# EAGLE design Adafruit 1.14-inch 240x135 Color TFT (EAGLE 9.3.2)
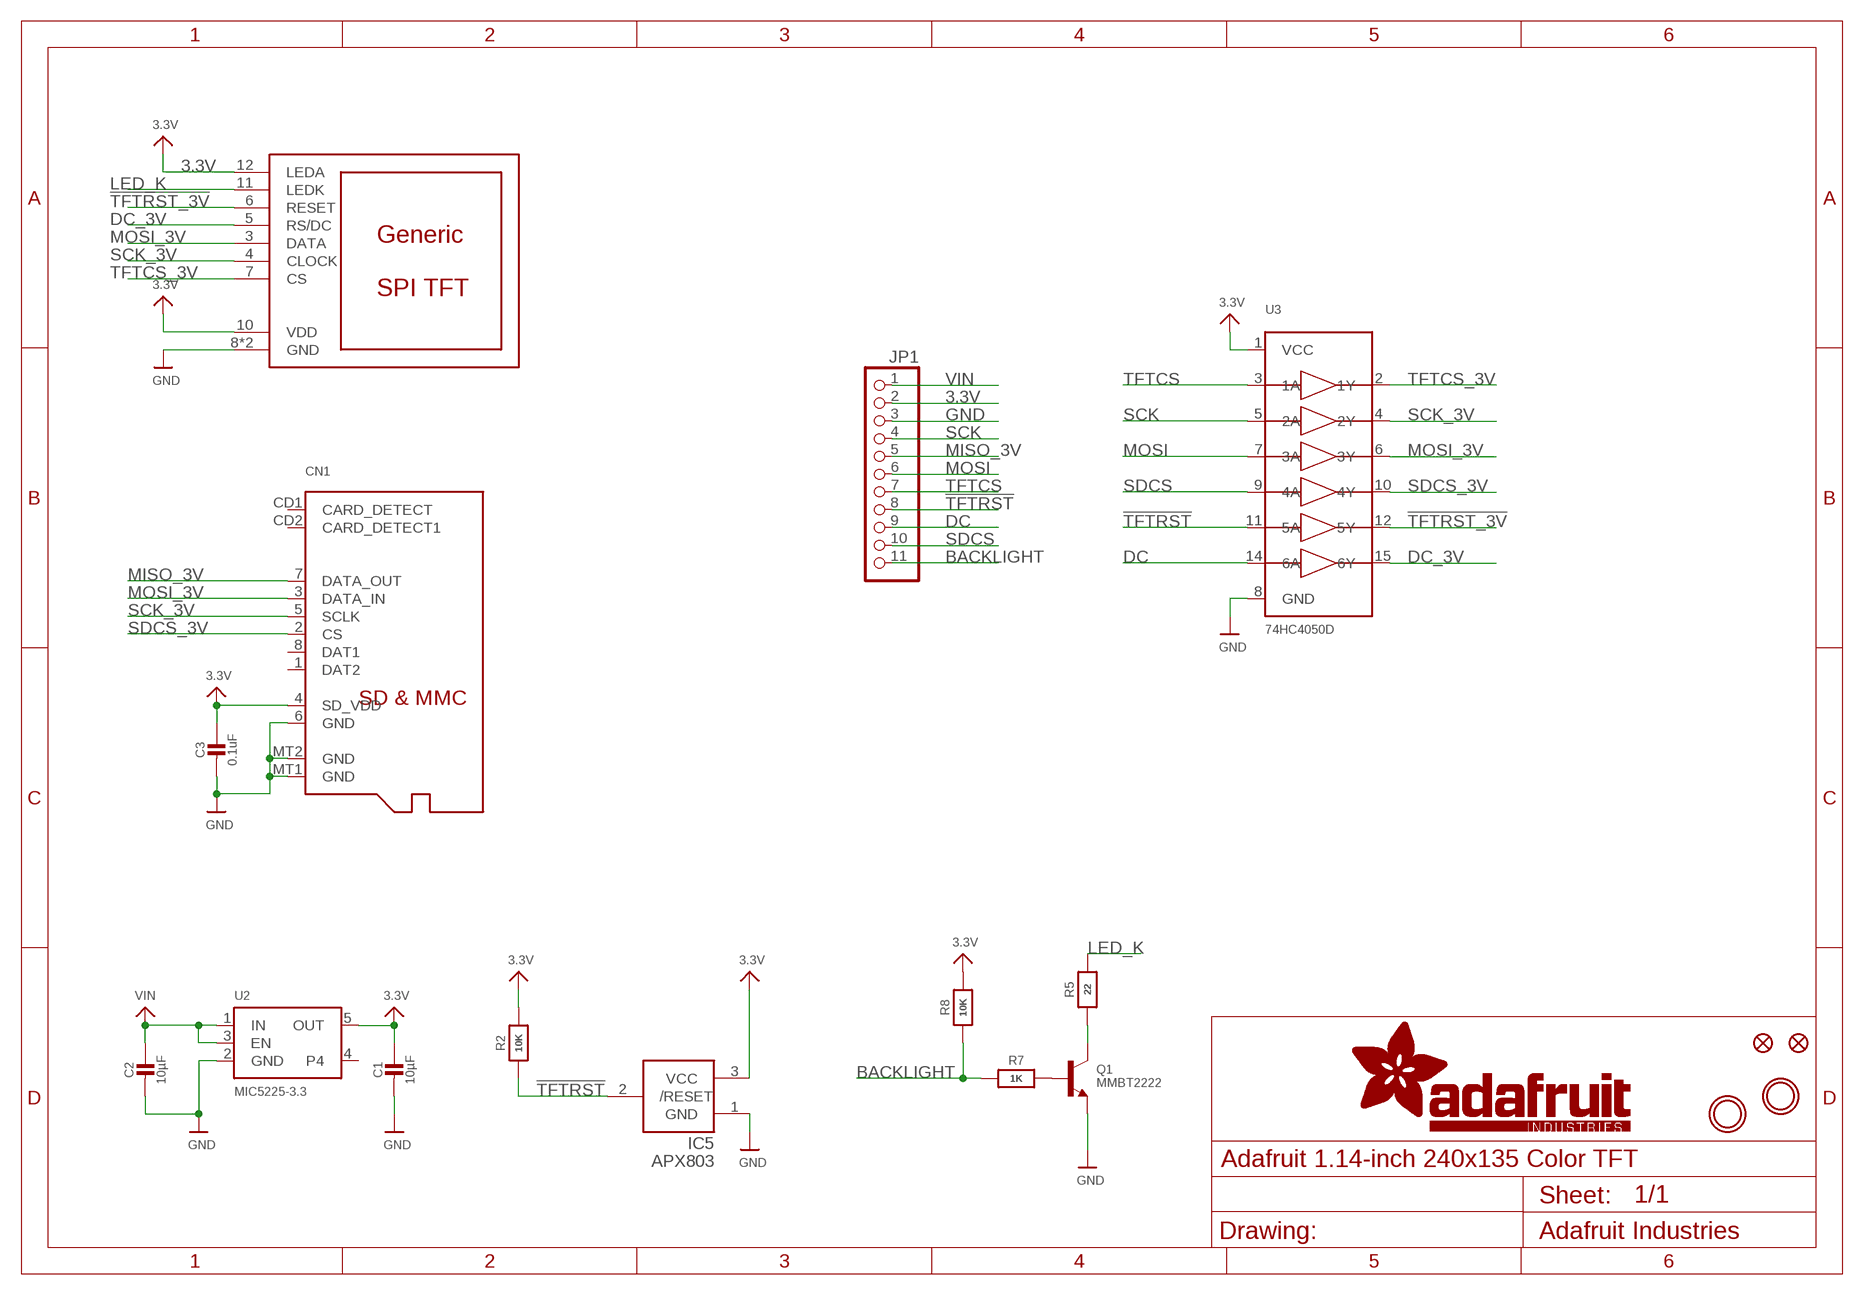
[diagram p0: schematic, sheet 1]

## Parts
C1  10µF  CAP_CERAMIC0805-NOOUTLINE  [0805-NO]
C2  10µF  CAP_CERAMIC0805-NOOUTLINE  [0805-NO]
C3  0.1uF  CAP_CERAMIC0805-NOOUTLINE  [0805-NO]
CN1  MICROSD  [MICROSD]
DISP1  DISP_LCD_GENERIC_SPI_1.14IN_240X135_WRAPUNDER  [TFT_1.14IN_240X135_WRAPUNDER]
FID1  FIDUCIAL_1MM  [FIDUCIAL_1MM]
FID2  FIDUCIAL_1MM  [FIDUCIAL_1MM]
IC5  APX803  AXP083-SAG  [SOT23]
JP1  HEADER-1X11  [1X11_ROUND]
Q1  MMBT2222  TRANSISTOR_NPNWIDE  [SOT23-WIDE]
R2  10K  RESISTOR_0603_NOOUT  [0603-NO]
R5  22  RESISTOR_0603_NOOUT  [0603-NO]
R7  1K  RESISTOR_0603_NOOUT  [0603-NO]
R8  10K  RESISTOR_0603_NOOUT  [0603-NO]
U2  MIC5225-3.3  VREG_SOT23-5  [SOT23-5]
U3  74HC4050D  [SOIC16]
U$9  MOUNTINGHOLE2.5  [MOUNTINGHOLE_2.5_PLATED]
U$10  MOUNTINGHOLE2.5  [MOUNTINGHOLE_2.5_PLATED]

## Nets
3.3V: C1.1 C3.1 CN1.4(SD_VDD) DISP1.10(VDD) DISP1.12(LEDA) IC5.3(VCC) JP1.2 R2.2 R8.2 U2.5(OUT) U3.1(VCC)
!TFTRST: IC5.2(/RESET) JP1.8 R2.1 U3.11(5A)
!TFTRST_3V: DISP1.6(RESET) U3.12(5Y)
BACKLIGHT: JP1.11 R7.1 R8.1
DC: JP1.9 U3.14(6A)
DC_3V: DISP1.5(RS/DC) U3.15(6Y)
GND: C1.2 C2.2 C3.2 CN1.6(GND) CN1.MT1(GND) CN1.MT2(GND) DISP1.8(GND) DISP1.13(GND) IC5.1(GND) JP1.3 Q1.2(E) U2.2(GND) U3.8(GND)
LED_K: DISP1.11(LEDK) R5.2
MISO_3V: CN1.7(DATA_OUT) JP1.5
MOSI: JP1.6 U3.7(3A)
MOSI_3V: CN1.3(DATA_IN) DISP1.3(DATA) U3.6(3Y)
N$1: Q1.1(B) R7.2
N$5: Q1.3(C) R5.1
SCK: JP1.4 U3.5(2A)
SCK_3V: CN1.5(SCLK) DISP1.4(CLOCK) U3.4(2Y)
SDCS: JP1.10 U3.9(4A)
SDCS_3V: CN1.2(CS) U3.10(4Y)
TFTCS: JP1.7 U3.3(1A)
TFTCS_3V: DISP1.7(CS) U3.2(1Y)
VIN: C2.1 JP1.1 U2.1(IN) U2.3(EN)
Unconnected: CN1.1(DAT2) CN1.8(DAT1) CN1.CD1(CARD_DETECT) CN1.CD2(CARD_DETECT1) U2.4

## Library data of the parts
C1-C3 = microbuilder:CAP_CERAMIC: Ceramic Capacitors For new designs, use the packages preceded by an '_' character since they are more reliable: The following footprints should be used on most boards: _0402 - Standard footprint for regular board layouts _0603 - Standard footprint for regular board layouts _0805 - Standard footprint for regular board layouts _1206 - Standard footprint for regular board layouts For extremely tight-pitch boards where space is at a premium, the following 'micro-pitch' footprints can be used (smaller pads, no silkscreen outline, etc.): _0402MP - Micro-pitch footprint for very dense/compact boards _0603MP - Micro-pitch footprint for very dense/compact boards _0805MP - Micro-pitch footprint for very dense/compact boards _1206MP - Micro-pitch footprint for very dense/compact boards
CN1 = microbuilder:MICROSD: MicroSD/Transflash Card Holder with SPI pinout 3M: 2908-05WB-MG 4UConnector: 19656 Footprint courtesy: Adafruit Industries
DISP1 = microbuilder:DISP_LCD_GENERIC_SPI
FID1 FID2 = microbuilder:FIDUCIAL: Fiducial Alignment Points Various fiducial points for machine vision alignment.; BOM: EXCLUDE
IC5 = adafruit:AXP083
JP1 = microbuilder:HEADER-1X11
Q1 = microbuilder:TRANSISTOR_NPN: NPN Transistor Transistor (NPN) 500mA 45V - BC817 [Digikey: 568-1631-1-ND] Transistor (NPN) 500mA 45V - BC817,215 [Mouser: 771-BC817-T/R] SOT23-R - SOT23 footprint optimised for use with solder paste and reflow ovens. SOT23-W - SOT23 footprint optimised for hand-soldering (larger pads).
R2 R5 R7 R8 = microbuilder:RESISTOR: Resistors For new designs, use the packages preceded by an '_' character since they are more reliable: The following footprints should be used on most boards: _0402 - Standard footprint for regular board layouts _0603 - Standard footprint for regular board layouts _0805 - Standard footprint for regular board layouts _1206 - Standard footprint for regular board layouts For extremely tight-pitch boards where space is at a premium, the following 'micro-pitch' footprints can be used (smaller pads, no silkscreen outline, etc.): _0402MP - Micro-pitch footprint for very dense/compact boards _0603MP - Micro-pitch footprint for very dense/compact boards _0805MP - Micro-pitch footprint for very dense/compact boards _1206MP - Micro-pitch footprint for very dense/compact boards
U2 = microbuilder:VREG_SOT23-5: SOT23-5 Fixed Voltage Regulators Part Current Out V Out V In V Dropout θJA (°C/W) TJ (°C) Digikey Part No. ADP121 150mA 3.3V 3.4-5.5V 0.09V @ 150mA -- -- ADP121-AUJZ33R7CT-ND ADP121 150mA 3.0V 3.1-5.5V 0.09V @ 150mA -- -- ADP121-AUJZ30R7CT-ND ADP122 300mA 3.3V 3.4-5.5V 0.085V @ 300mA -- -- ADP122AUJZ-3.3-R7CT-ND ADP1712 300mA 3.3V 3.5-5.5V 0.17V @ 300mA -- -- ADP1712AUJZ-3.3-R7TR-ND AP7311 (Low Cost) 150mA 3.3V 3.5-6V 0.15V @ 150mA -- -- AP7311-33WG-7DICT-ND LD39015M18R 150mA 1.8V 1.9V-5.5V 0.08V @ 100mA -- -- 497-6977-1-ND LP2985A-33DBVR 150mA 3.3V 3.3-16V 0.28V @ 150mA 206 150 296-18479-1-ND MCP1824T-3302E/OT 300mA 3.3V 3.5V-6V 0.2V @ 300mA -- -- MCP1824T-3302E/OTCT-ND MIC5205-2.5YM5 TR 150mA 2.5V 2.7-16V 0.165V @ 150mA -- -- 576-1257-2-ND MIC5205-3.0YM5 TR 150mA 3.0V 3.2V-16V 0.165V @ 150mA -- -- 576-1258-2-ND MIC5205-3.3YM5 TR 150mA 3.3V 3.5V-16V 0.165V @ 150mA -- -- 576-1259-2-ND TPS780330220 150mA 3.3V+2.2V 3.6-5.5V 250mV Max -- -- 296-23332-1-ND TDA3663/N1,135 100mA 3.3V 3.5-45V 0.18V @ 50mA -- -- 568-5343-1-ND Max operating temp can be calculated using θJA, TJ (max junction temperature), and power in watts. Set the "Maximum Ambient Temperature" until it reaches TJ ("Max Junction Temperature"), which is the absolute limit for safe use of the regulator: Heat Sink Temperature Calculator <http://www.daycounter.com/Calculators/Heat-Sink-Temperature-Calculator.phtml> For example, With 12V source into a 3.3V LP2985 and a 30mA load, we are dissipating (12V-3.3V) * 0.03A = 0.261W. With a θJA of 206 °C/W, a TJ of 150°C, and 261mW we can safely use the chip without a heat sink up to 75°C (=147.1°C Junction Temperature).
U3 = microbuilder:74HC4050D: 6-channel level shifter 74HC4050D - 2V-6V Supply SOIC16 Digikey: 74HC4050D,653-ND Mouser: 771-74HC4050D-T TSSOP16 Digikey: 296-9215-1-ND Mouser:
U$9 U$10 = microbuilder:MOUNTINGHOLE: Mounting Hole For #2 screws (0.086"/2.18mm width, 0.094"/2.4mm hole) use 2.5mm; BOM: EXCLUDE

## Board
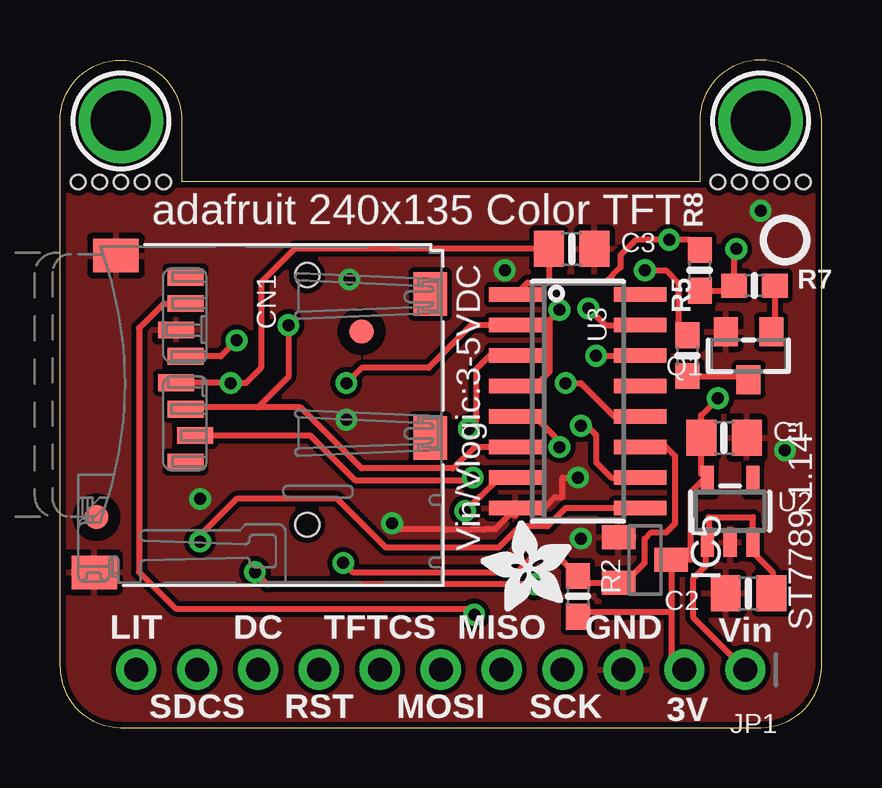
[diagram p1: board, top side]
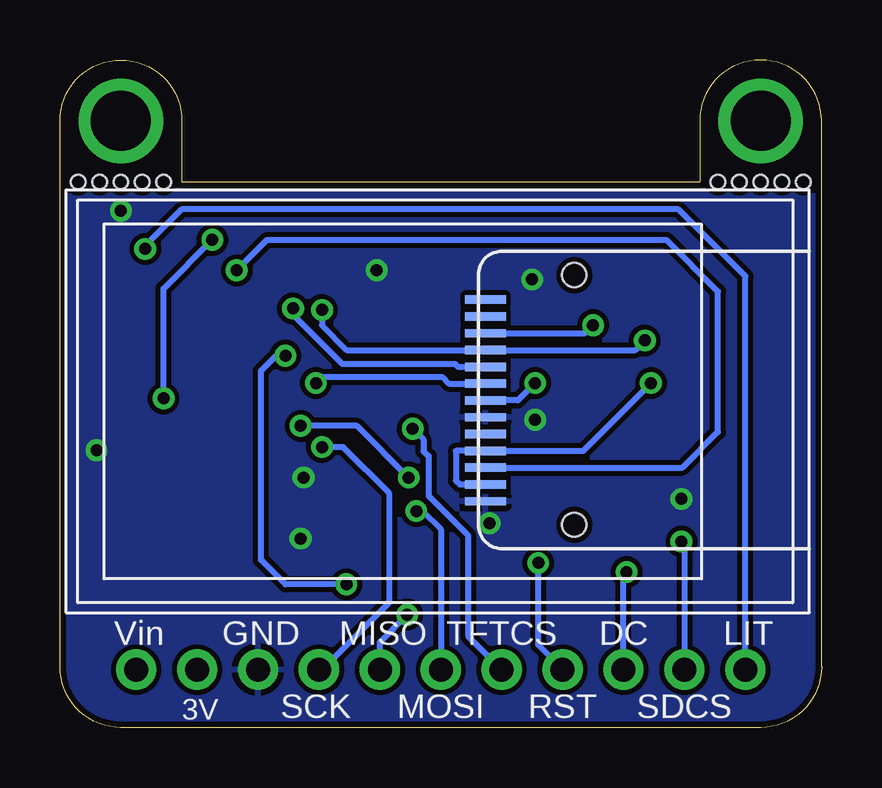
[diagram p2: board, bottom side, seen from below]

Size 31.75 x 27.81 mm. Coordinates in mm from the lower left corner, seen from the top.
Outline: 0,2.54 0,25.27 arc-90 2.54,27.81 arc-90 5.08,25.27 5.08,22.73 26.67,22.73 26.67,25.27 arc-90 29.21,27.81 arc-90 31.75,25.27 31.75,2.54 arc-90 29.21,0 2.54,0 arc-90 0,2.54
Copper layers (1*16): Top 0.035mm / dielectric 1.5mm / Bottom 0.035mm
Design rules "adafruit *": minimum track width 8mil, minimum drill 15.5mil, track to track 8mil, track to pad 8mil, pad to pad 8mil, via to via 8mil, smd to smd 8mil, copper to edge 10mil, drill to drill 8mil, minimum pad ring 10mil, minimum via ring 8mil, stop-mask expansion 2mil, vias tented up to drill 20mil, thermal gap 10mil
Holes 0.6 mm at 4.32,22.73 3.43,22.73 2.54,22.73 1.65,22.73 0.76,22.73 30.99,22.73 30.1,22.73 29.21,22.73 28.32,22.73 27.43,22.73

### Footprints (pad centres in the part's own frame; a part is rotated, then mirrored left to right if it is on the bottom)
0805-NO = smd 1.24 x 1.5: 1 -0.95,0; 2 0.95,0
MICROSD = smd 0.7 x 1.5: 1 9,-10.64; 2 7.9,-10.24; 3 6.8,-10.64; 4 5.7,-11.04; 5 4.6,-10.64; 6 3.5,-11.04; 7 2.4,-10.64; 8 1.3,-10.64 | smd 1.8 x 1.4: CD1 2,-0.44; CD2 8,-0.44 | smd 1.4 x 1.9: MT1 0.4,-13.54; MT2 13.6,-14.44
TFT_1.14IN_240X135_WRAPUNDER = smd 0.35 x 1.7: 1 4.24,13.5; 2 3.54,13.5; 3 2.84,13.5; 4 2.14,13.5; 5 1.44,13.5; 6 0.74,13.5; 7 0.04,13.5; 8 -0.66,13.5; 9 -1.36,13.5; 10 -2.06,13.5; 11 -2.76,13.5; 12 -3.46,13.5; 13 -4.16,13.5 | hole 1: -5.14,9.8; 5.26,9.8
FIDUCIAL_1MM = smd 1 x 1: 1 0,0
SOT23 = smd 1 x 1.4: 1 -0.95,-1.1; 2 0.95,-1.1; 3 0,1.1
1X11_ROUND = drill 1 pad 1.676: 1 -12.7,0; 2 -10.16,0; 3 -7.62,0; 4 -5.08,0; 5 -2.54,0; 6 0,0; 7 2.54,0; 8 5.08,0; 9 7.62,0; 10 10.16,0; 11 12.7,0
SOT23-WIDE = smd 1 x 1.2: 1 -0.95,-1; 2 0.95,-1; 3 0,1
0603-NO = smd 1.075 x 1: 1 -0.85,0; 2 0.85,0
SOT23-5 = smd 0.55 x 1.2: 1 -0.95,-1.3; 2 0,-1.3; 3 0.95,-1.3; 4 0.95,1.3; 5 -0.95,1.3
SOIC16 = smd 0.6 x 2.2: 1 -4.445,-2.6; 2 -3.175,-2.6; 3 -1.905,-2.6; 4 -0.635,-2.6; 5 0.635,-2.6; 6 1.905,-2.6; 7 3.175,-2.6; 8 4.445,-2.6; 9 4.445,2.6; 10 3.175,2.6; 11 1.905,2.6; 12 0.635,2.6; 13 -0.635,2.6; 14 -1.905,2.6; 15 -3.175,2.6; 16 -4.445,2.6
MOUNTINGHOLE_2.5_PLATED = drill 2.5 pad 3.2: P$1 0,0

### Placement (x,y rotation side)
C1  27.69,12.06 0 top
C2  28.7,5.59 180 top
C3  21.34,19.94 0 top
CN1  15.88,20.07 270 top
DISP1  0.51,13.59 90 bottom
FID1  1.52,8.76 0 top
FID2  12.57,16.51 0 top
IC5  24.38,6.98 270 top
JP1  15.88,2.41 180 top
Q1  28.7,15.49 180 top
R2  21.59,5.46 270 top
R5  26.16,15.49 90 top
R7  28.96,18.41 0 top
R8  26.67,19.05 90 top
U2  27.94,9.02 0 top
U3  21.59,13.59 270 top
U$4  MICROSD  [ADAFRUIT_3.5MM]  21.34,4.83 90 top
U$6  [PCBFEAT-REV-040]  30.23,20.32 0 top
U$9  2.54,25.27 0 top
U$10  29.21,25.27 0 top

### Tracks (layer width: path | path; a pad name or v marks a point on that pad's centre or on a via)
3.3V  (via drill 0.5)
  Top 0.254: U3.1 19.5,18.54 20.39,18.54 | 25.48,4.83 IC5.3 26.29,6.98 26.29,9.78 26.83,10.32 U2.5 26.74,10.57 C1.1 26.74,13.02 v27.43,13.72 | 25.48,4.83 25.48,2.96 JP1.2 | R8.2 26.25,20.32 v25.4,20.32 24,20.32 23.37,19.69 23.37,19.18 22.73,18.54 20.39,18.54 | 25.48,4.83 21.8,4.83 R2.2 | 20.39,18.54 C3.1 9.77,19.94 8.38,18.55 8.38,14.99 7.75,14.35 v7.11,14.35 7.1,14.37 CN1.4
  Bottom 0.254: v7.11,14.35 9.93,11.53 DISP1.10 15.24,11.53 15.24,10.29 15.08,10.13 DISP1.12 | v25.4,20.32 27.43,18.29 v27.43,13.72
!TFTRST  (via drill 0.5)
  Top 0.254: v11.81,6.86 12.19,6.48 19.05,6.48 19.77,7.2 20.7,7.2 R2.1 21.87,6.04 IC5.2 23.56,6.04 24.38,6.86 24.38,7.87 24.64,8.13 25.27,8.13 25.65,8.51 25.65,11.3 25.27,11.68 U3.11
  Bottom 0.254: JP1.8 11.81,3.43 v11.81,6.86
!TFTRST_3V  (via drill 0.5)
  Top 0.254: v21.08,14.35 21.72,14.35 23.11,12.95 U3.12
  Bottom 0.254: v21.08,14.35 20.83,14.61 15.81,14.61 15.53,14.33 DISP1.6
BACKLIGHT  (via drill 0.5)
  Top 0.254: R8.1 27.89,18.2 R7.1 28.11,19.85 v28.19,19.94
  Bottom 0.254: JP1.11 3.17,18.8 5.97,21.59 26.67,21.59 28.19,20.07 v28.19,19.94
DC  (via drill 0.5)
  Top 0.254: v19.81,5.97 8.64,5.97 v8.13,6.48 | v22.35,15.49 U3.14
  Bottom 0.254: v22.35,15.49 22.73,15.49 23.37,14.86 23.37,6.98 22.35,5.97 v19.81,5.97 | JP1.9 8.25,6.35 v8.13,6.48
DC_3V  (via drill 0.5)
  Top 0.254: v22.04,17.46 22.73,16.76 U3.15
  Bottom 0.254: DISP1.5 15.15,15.03 15.28,15.16 19.98,15.16 22.04,17.21 v22.04,17.46
GND  (via drill 0.5)
  Top 0.254: v21.59,10.41 20.96,10.41 20.96,9.6 20.62,9.6 20.17,9.14 U3.8 18.99,8.84 18.72,8.84 18.14,8.25 17.67,8.25 17.67,8.23 16.11,8.23 16.11,8.25 14.1,8.25 v13.84,8.51
  other vias: 21.72,7.87 5.84,9.53 11.94,12.83 12.07,18.67 18.54,19.05 30.23,11.56 29.21,21.53
  pour Top: 31.75,22.61 0.13,22.61 0.13,0.13 31.75,0.13
  pour Bottom: 31.75,22.61 0.13,22.61 0.13,0.13 31.75,0.13
LED_K  (via drill 0.5)
  Top 0.254: v24.38,19.05 25.27,19.05 25.78,18.54 25.78,16.76 26.2,16.34 R5.2
  Bottom 0.254: v24.38,19.05 23.11,20.32 6.48,20.32 4.32,18.16 4.32,12.32 5.81,10.83 DISP1.11
MISO_3V  (via drill 0.5)
  Top 0.254: v17.27,4.7 17.27,4.95 4.83,4.95 3.3,6.48 3.3,16.64 4.33,17.67 CN1.7
  Bottom 0.254: JP1.5 18.41,3.56 v17.27,4.7
MOSI  (via drill 0.5)
  Top 0.254: 17.02,9.02 v16.89,9.02 17.5,9.63 17.53,9.63 18.32,10.41 U3.7
  Bottom 0.254: v16.89,9.02 16.64,9.02 15.88,8.25 JP1.6
MOSI_3V  (via drill 0.5)
  Top 0.254: CN1.3 5.3,13.34 8.25,13.34 | U3.6 17.27,11.68 16.38,10.79 12.57,10.79 10.03,13.34 8.25,13.34 | v9.52,16.76 9.52,14.61 8.25,13.34
  Bottom 0.254: DISP1.3 9.86,16.43 v9.52,16.76
N$1
  Top 0.254: R7.2 29.81,16.65 Q1.1
N$5
  Top 0.254: R5.1 28.55,14.64 Q1.3
SCK  (via drill 0.5)
  Top 0.254: U3.5 19.81,12.95 20.83,11.94 v20.83,11.68
  Bottom 0.254: v20.83,11.68 19.94,11.68 18.03,9.78 18.03,5.21 20.83,2.41 JP1.4
SCK_3V  (via drill 0.5)
  Top 0.254: v7.37,16.13 6.7,15.47 CN1.5 | U3.4 19.81,14.22 20.43,14.84 20.43,17 v20.83,17.4
  Bottom 0.254: v7.37,16.13 7.77,15.73 DISP1.4 19.79,15.73 20.83,16.76 v20.83,17.4
SDCS  (via drill 0.5)
  Top 0.254: U3.9 21.08,9.14 20.32,8.38 19.18,8.38 18.86,8.06 18.29,7.49 13.59,7.49 11.56,9.53 7.37,9.53 5.84,8 v5.84,7.75
  Bottom 0.254: v5.84,7.75 5.71,7.62 JP1.10
SDCS_3V  (via drill 0.5)
  Top 0.254: v21.72,12.57 21.97,12.57 22.35,12.19 22.35,11.05 22.99,10.41 U3.10 | v17.21,10.41 17.08,10.29 12.32,10.29 10.44,12.17 CN1.2
  Bottom 0.254: v21.72,12.57 19.37,12.57 v17.21,10.41
TFTCS  (via drill 0.5)
  Top 0.254: U3.3 17.91,15.49 17.34,14.92 17.34,12.74 v17.04,12.45
  Bottom 0.254: JP1.7 14.73,3.81 14.73,8 16.38,9.65 16.38,11.3 16.6,11.52 16.6,12 v17.04,12.45
TFTCS_3V  (via drill 0.5)
  Top 0.254: U3.2 17.14,16.76 15.37,14.99 12.57,14.99 v11.94,14.35
  Bottom 0.254: v11.94,14.35 12.66,13.63 DISP1.7
VIN
  Top 0.254: JP1.1 26.42,4.57 26.42,6.22 26.92,6.73 26.92,7.65 U2.1 27.05,7.78 27.05,8.76 28.89,8.76 U2.3 28.89,7.3 29.72,6.48 29.72,5.65 C2.1

### Text on the board
tPlace: adafruit 240x135 Color TFT | Vin/Vlogic:3-5VDC | LIT | DC | TFTCS | MISO | GND | Vin | ST7789 1.14" | SDCS | RST | MOSI | SCK | 3V
bPlace: LIT | DC | TFTCS | MISO | GND | Vin | SDCS | RST | MOSI | SCK | 3V